# Altium schematic sheet MCU.SchDoc
size A4
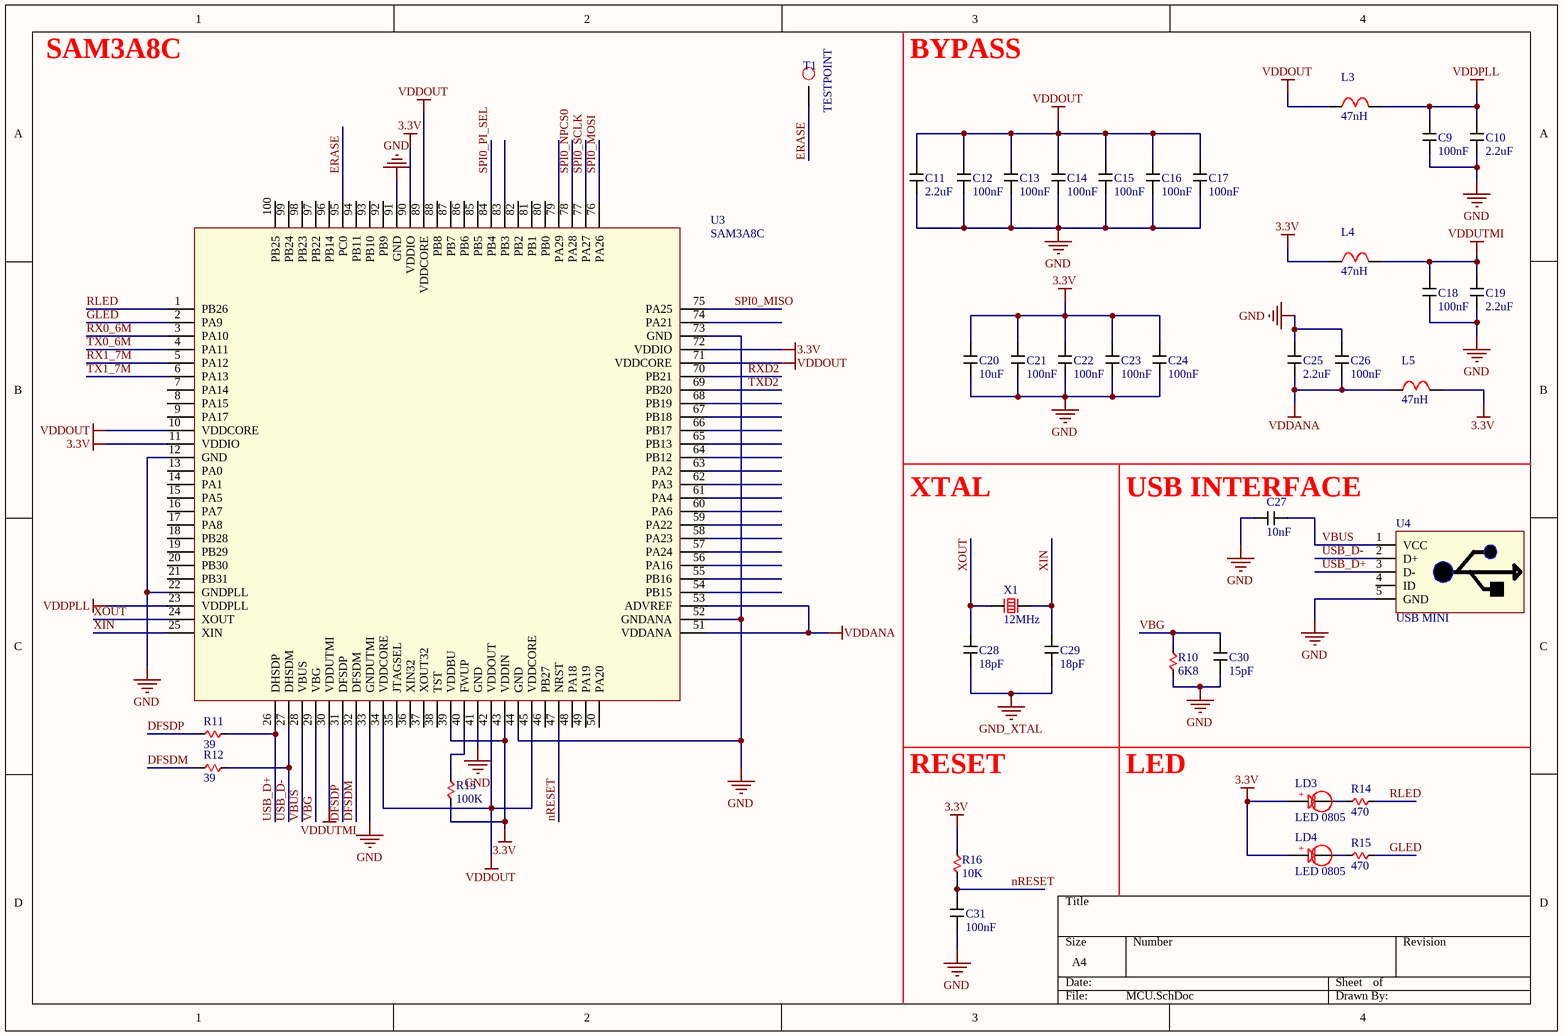
[diagram p0: MCU.SchDoc]

## Parts
C9  100nF  [C 0805]
C10  2.2uF  [C 0805]
C11  2.2uF  [C 0805]
C12  100nF  [C 0805]
C13  100nF  [C 0805]
C14  100nF  [C 0805]
C15  100nF  [C 0805]
C16  100nF  [C 0805]
C17  100nF  [C 0805]
C18  100nF  [C 0805]
C19  2.2uF  [C 0805]
C20  10uF  [C 0805]
C21  100nF  [C 0805]
C22  100nF  [C 0805]
C23  100nF  [C 0805]
C24  100nF  [C 0805]
C25  2.2uF  [C 0805]
C26  100nF  [C 0805]
C27  10nF  [C 0805]
C28  18pF  [C 0805]
C29  18pF  [C 0805]
C30  15pF  [C 0805]
C31  100nF  [C 0805]
L3  47nH  [L 0805]
L4  47nH  [L 0805]
L5  47nH  [L 0805]
LD3  LED 0805  [LED 0805]
LD4  LED 0805  [LED 0805]
R10  6K8  [R 0805]
R11  39  [R 0805]
R12  39  [R 0805]
R13  100K  [R 0805]
R14  470  [R 0805]
R15  470  [R 0805]
R16  10K  [R 0805]
T1  TESTPOINT  [TEST_POINT]
U3  SAM3A8C  [SAM3A8C]
U4  USB MINI  [USB MINI DIP]
X1  12MHz  [XTAL]

## Nets
3.3V: C20.2 C21.2 C22.2 C23.2 C24.2 L4.1 L5.1 LD3.1 LD4.1 R13.1 R16.2 U3.11(VDDIO) U3.39(VDDBU) U3.43(VDDIN) U3.72(VDDIO) U3.90(VDDIO)
GND: C9.1 C10.1 C11.1 C12.1 C13.1 C14.1 C15.1 C16.1 C17.1 C18.1 C19.1 C20.1 C21.1 C22.1 C23.1 C24.1 C25.1 C26.1 C27.2 C30.1 C31.1 R10.1 U3.12(GND) U3.22(GNDPLL) U3.33(GNDUTMI) U3.41(GND) U3.44(GND) U3.52(GNDANA) U3.73(GND) U3.91(GND) U4.5(GND)
GND_XTAL: C28.1 C29.1
VDDANA: C25.2 C26.2 L5.2 U3.51(VDDANA) U3.53(ADVREF)
VDDOUT: C11.2 C12.2 C13.2 C14.2 C15.2 C16.2 C17.2 L3.1 U3.10(VDDCORE) U3.34(VDDCORE) U3.42(VDDOUT) U3.45(VDDCORE) U3.71(VDDCORE) U3.89(VDDCORE)
VDDPLL: C9.2 C10.2 L3.2 U3.23(VDDPLL)
VDDUTMI: C18.2 C19.2 L4.2 U3.30(VDDUTMI)
DFSDM: R12.1 U3.32(DFSDM)
DFSDP: R11.1 U3.31(DFSDP)
ERASE: T1.1 U3.95(PC0)
GLED: R15.1 U3.2(PA9)
nRESET: C31.2 R16.1 U3.47(NRST)
RLED: R14.1 U3.1(PB26)
RX0_6M: U3.3(PA10)
RX1_7M: U3.5(PA12)
RXD2: U3.70(PB21)
SPI0_MISO: U3.75(PA25)
SPI0_MOSI: U3.76(PA26)
SPI0_NPCS0: U3.78(PA28)
SPI0_PI_SEL: U3.84(PB4)
SPI0_SCLK: U3.77(PA27)
TX0_6M: U3.4(PA11)
TX1_7M: U3.6(PA13)
TXD2: U3.69(PB20)
USB_D+: R11.2 U3.26(DHSDP) U4.3(D-)
USB_D-: R12.2 U3.27(DHSDM) U4.2(D+)
VBG: C30.2 R10.2 U3.29(VBG)
VBUS: C27.1 U3.28(VBUS) U4.1(VCC)
XIN: C29.2 U3.25(XIN) X1.2
XOUT: C28.2 U3.24(XOUT) X1.1
NetLD3_2: LD3.2 R14.2
NetLD4_2: LD4.2 R15.2
NetR13_2: R13.2 U3.40(FWUP)

Not connected (* = marked no-connect by the designer): U3 7(PA14) 8(PA15) 9(PA17) 13(PA0) 14(PA1) 15(PA5) 16(PA7) 17(PA8) 18(PB28) 19(PB29) 20(PB30) 21(PB31) 35(JTAGSEL) 36(XIN32) 37(XOUT32) 38(TST) 46(PB27) 48(PA18) 49(PA19) 50(PA20) 54(PB15) 55(PB16) 56(PA16) 57(PA24) 58(PA23) 59(PA22) 60(PA6) 61(PA4) 62(PA3) 63(PA2) 64(PB12) 65(PB13) 66(PB17) 67(PB18) 68(PB19) 74(PA21) 79(PA29) 80(PB0) 81(PB1) 82(PB2) 83(PB3) 85(PB5) 86(PB6) 87(PB7) 88(PB8) 92(PB9) 93(PB10) 94(PB11) 96(PB14) 97(PB22) 98(PB23) 99(PB24) 100(PB25); U4 4(ID)

## Notes on the sheet
- SAM3A8C
- BYPASS
- XTAL
- (near C27) USB INTERFACE
- RESET
- LED
- (in symbol LED 0805) +

## Library data of the parts
C9-C31 = C 0805
L3-L5 = L 0805
R10-R16 = R 0805
T1 = TEST_POINT
U4 = USB TYPE B
X1 = XTAL